# Altium schematic sheet DingDong.SchDoc
size A; SheetNumber: 1; SheetTotal: 1
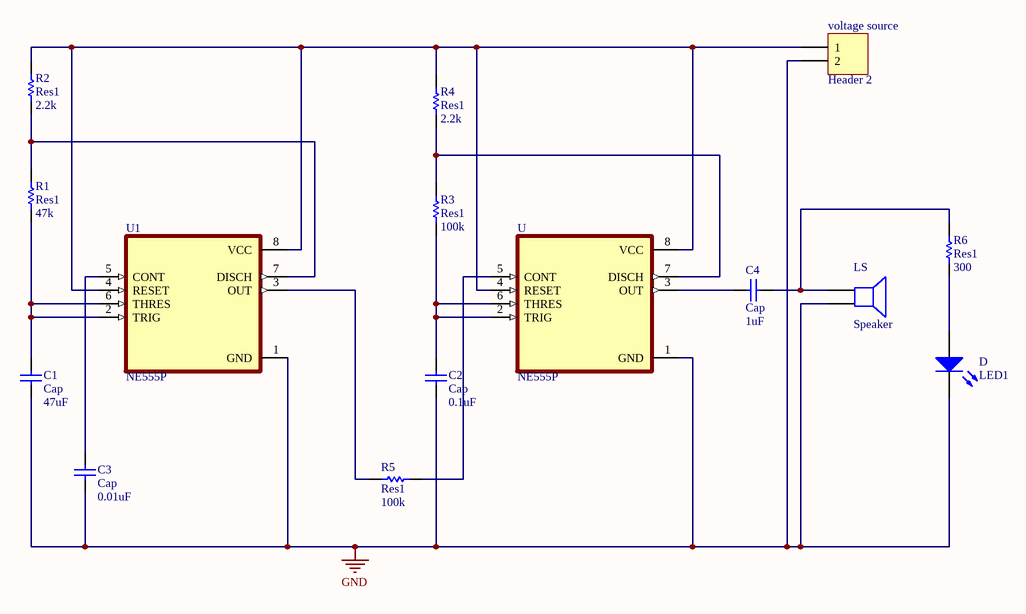
[diagram p0: DingDong.SchDoc]

## Parts
C1  Cap  value 47uF  [RAD-0.3]
C2  Cap  value 0.1uF  [RAD-0.3]
C3  Cap  value 0.01uF  [RAD-0.3]
C4  Cap  value 1uF  [RAD-0.3]
D  LED1  [LED-1]
LS  Speaker  [PIN2]
R1  Res1  value 47k  [AXIAL-0.3]
R2  Res1  value 2.2k  [AXIAL-0.3]
R3  Res1  value 100k  [AXIAL-0.3]
R4  Res1  value 2.2k  [AXIAL-0.3]
R5  Res1  value 100k  [AXIAL-0.3]
R6  Res1  value 300  [AXIAL-0.3]
U  NE555P  [DIP794W45P254L959H508Q8]
U1  NE555P  [DIP794W45P254L959H508Q8]
voltage_source  Header 2  [HDR1X2]

## Nets
GND: C1.1 C2.1 C3.1 D.2(K) LS.2 U.1(GND) U1.1(GND) voltage_source.2
NetC1_2: C1.2 R1.1 U1.2(TRIG) U1.6(THRES)
NetC2_2: C2.2 R3.1 U.2(TRIG) U.6(THRES)
NetC3_2: C3.2 U1.5(CONT)
NetC4_1: C4.1 U.3(OUT)
NetC4_2: C4.2 LS.1 R6.2
NetD_1: D.1(A) R6.1
NetR1_2: R1.2 R2.1 U1.7(DISCH)
NetR2_2: R2.2 R4.2 U.4(RESET) U.8(VCC) U1.4(RESET) U1.8(VCC) voltage_source.1
NetR3_2: R3.2 R4.1 U.7(DISCH)
NetR5_1: R5.1 U1.3(OUT)
NetR5_2: R5.2 U.5(CONT)

## Library data of the parts
C1-C4 = Cap: Capacitor; Published: 8-Jun-2000; LatestRevisionDate: 17-Jul-2002; LatestRevisionNote: Re-released for DXP Platform.; PackageReference: RAD-0.3; Publisher: Altium Limited; PackageDescription: Radial Cap, Thru-Hole; 2 Leads; 0.3 in Pin Spacing
D = LED1: Typical RED GaAs LED; Published: 8-Jun-2000; LatestRevisionDate: 08-Jul-2005; LatestRevisionNote: Mech Layer 1 removed.; PackageReference: LED-1; Publisher: Altium Limited; PackageDescription: LED; 2 Leads
LS = Speaker: Loudspeaker; Published: 24-Mar-1999; LatestRevisionDate: 17-Jul-2002; LatestRevisionNote: Re-released for DXP Platform.; PackageReference: PIN2; Publisher: Altium Limited
R1-R6 = Res1: Resistor; Published: 8-Jun-2000; LatestRevisionDate: 17-Jul-2002; LatestRevisionNote: Re-released for DXP Platform.; PackageReference: AXIAL-0.3; Publisher: Altium Limited; PackageDescription: Axial Device, Thru-Hole; 2 Leads; 0.3 in Pin Spacing
U U1 = NE555P: Single Precision Timer; MF: Texas Instruments; Package: PDIP-8 Texas Instruments; Value: *; MP: NE555P; Texas_Instruments-Purchase-URL: https://snapeda.com/shop?store=Texas+Instruments&id=2776400; Arrow_Electronics-Purchase-URL: https://snapeda.com/shop?store=Arrow+Electronics&id=2776400; Mouser-Purchase-URL: https://snapeda.com/shop?store=Mouser&id=2776400; DigiKey-Purchase-URL: https://snapeda.com/shop?store=DigiKey&id=2776400; SnapEDA_Link: https://www.snapeda.com/parts/NE555P/Texas%20Instruments/view-part/2776400/?ref=snap
voltage_source = Header 2: Header, 2-Pin; LatestRevisionDate: 17-Jul-2002; LatestRevisionNote: Re-released for DXP Platform.; Publisher: Altium Limited